# Altium schematic sheet GENN0003.SchDoc: Tray Inteconnect Diagram
size A3; Author: M. Wenke, Cam Brown; Engineer: M. Wenke, Cam Brown; Address1: BLUEsat Project; Address2: EE419; Address3: c/o Schoo of EE&T; Address4: UNSW; DocumentNumber: GENN0003; SheetNumber: 1; SheetTotal: 1; Description: BlueSat's subsystems and required interconnects; Version: 1.0
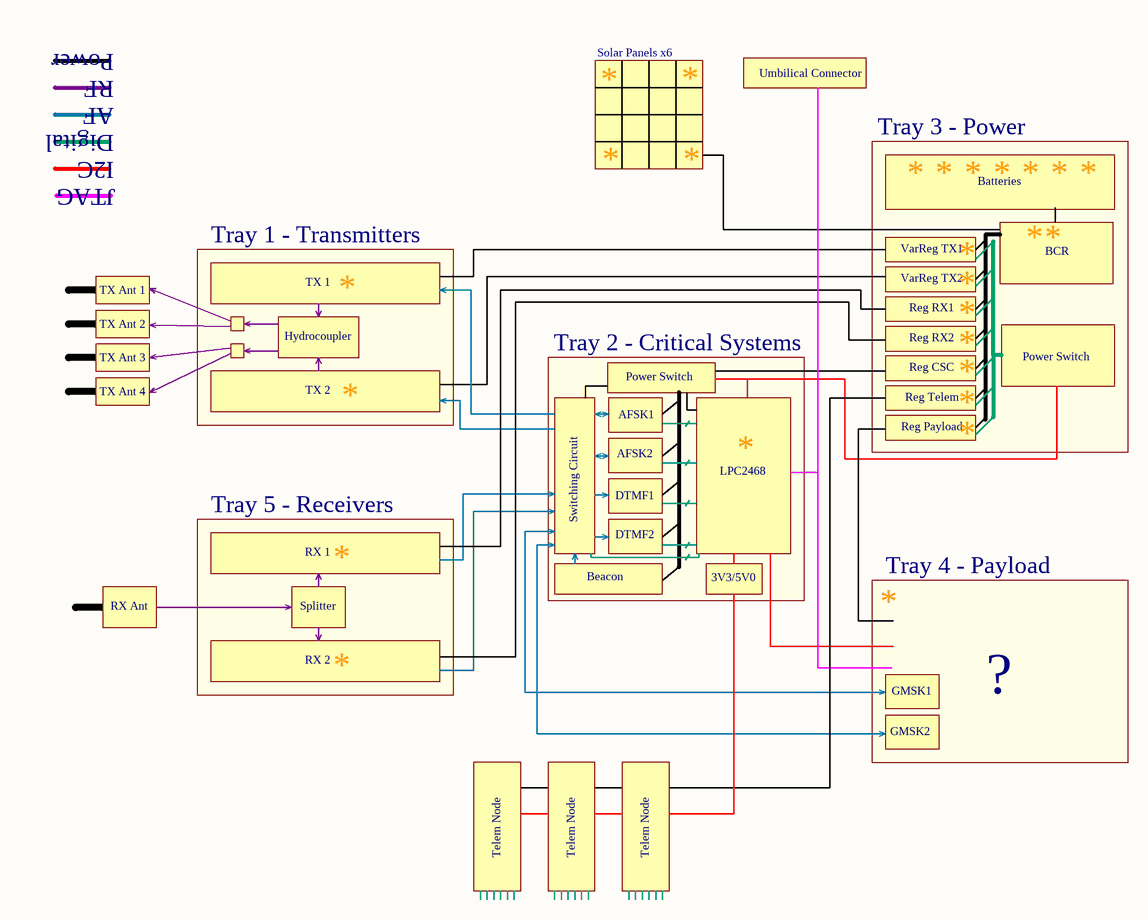
[diagram p0: GENN0003.SchDoc]

## Notes on the sheet
- Power
- RF
- AF
- *
- Solar Panels x6
- Umbilical Connector
- Digital
- I2C
- Tray 3 - Power
- JTAG
- Batteries
- TX Ant 1
- Tray 1 - Transmitters
- TX 1
- VarReg TX1
- VarReg TX2
- BCR
- TX Ant 2
- TX Ant 3
- Hydrocoupler
- Tray 2 - Critical Systems
- Reg RX1
- Reg RX2
- Reg CSC
- Power Switch
- TX Ant 4
- TX 2
- AFSK1
- Reg Telem
- Reg Payload
- Switching Circuit
- AFSK2
- DTMF1
- LPC2468
- Tray 5 - Receivers
- RX 1
- DTMF2
- Tray 4 - Payload
- RX Ant
- Splitter
- Beacon
- 3V3/5V0
- RX 2
- GMSK1
- ?
- GMSK2
- Telem Node
- Title
- Description:
- Size:
- Author:
- Date:
- A3
- Time:
- Version
- Sheet:
- Drawing No.:
- of
- File: